# EAGLE design stm32l021 (EAGLE 9.6.2)
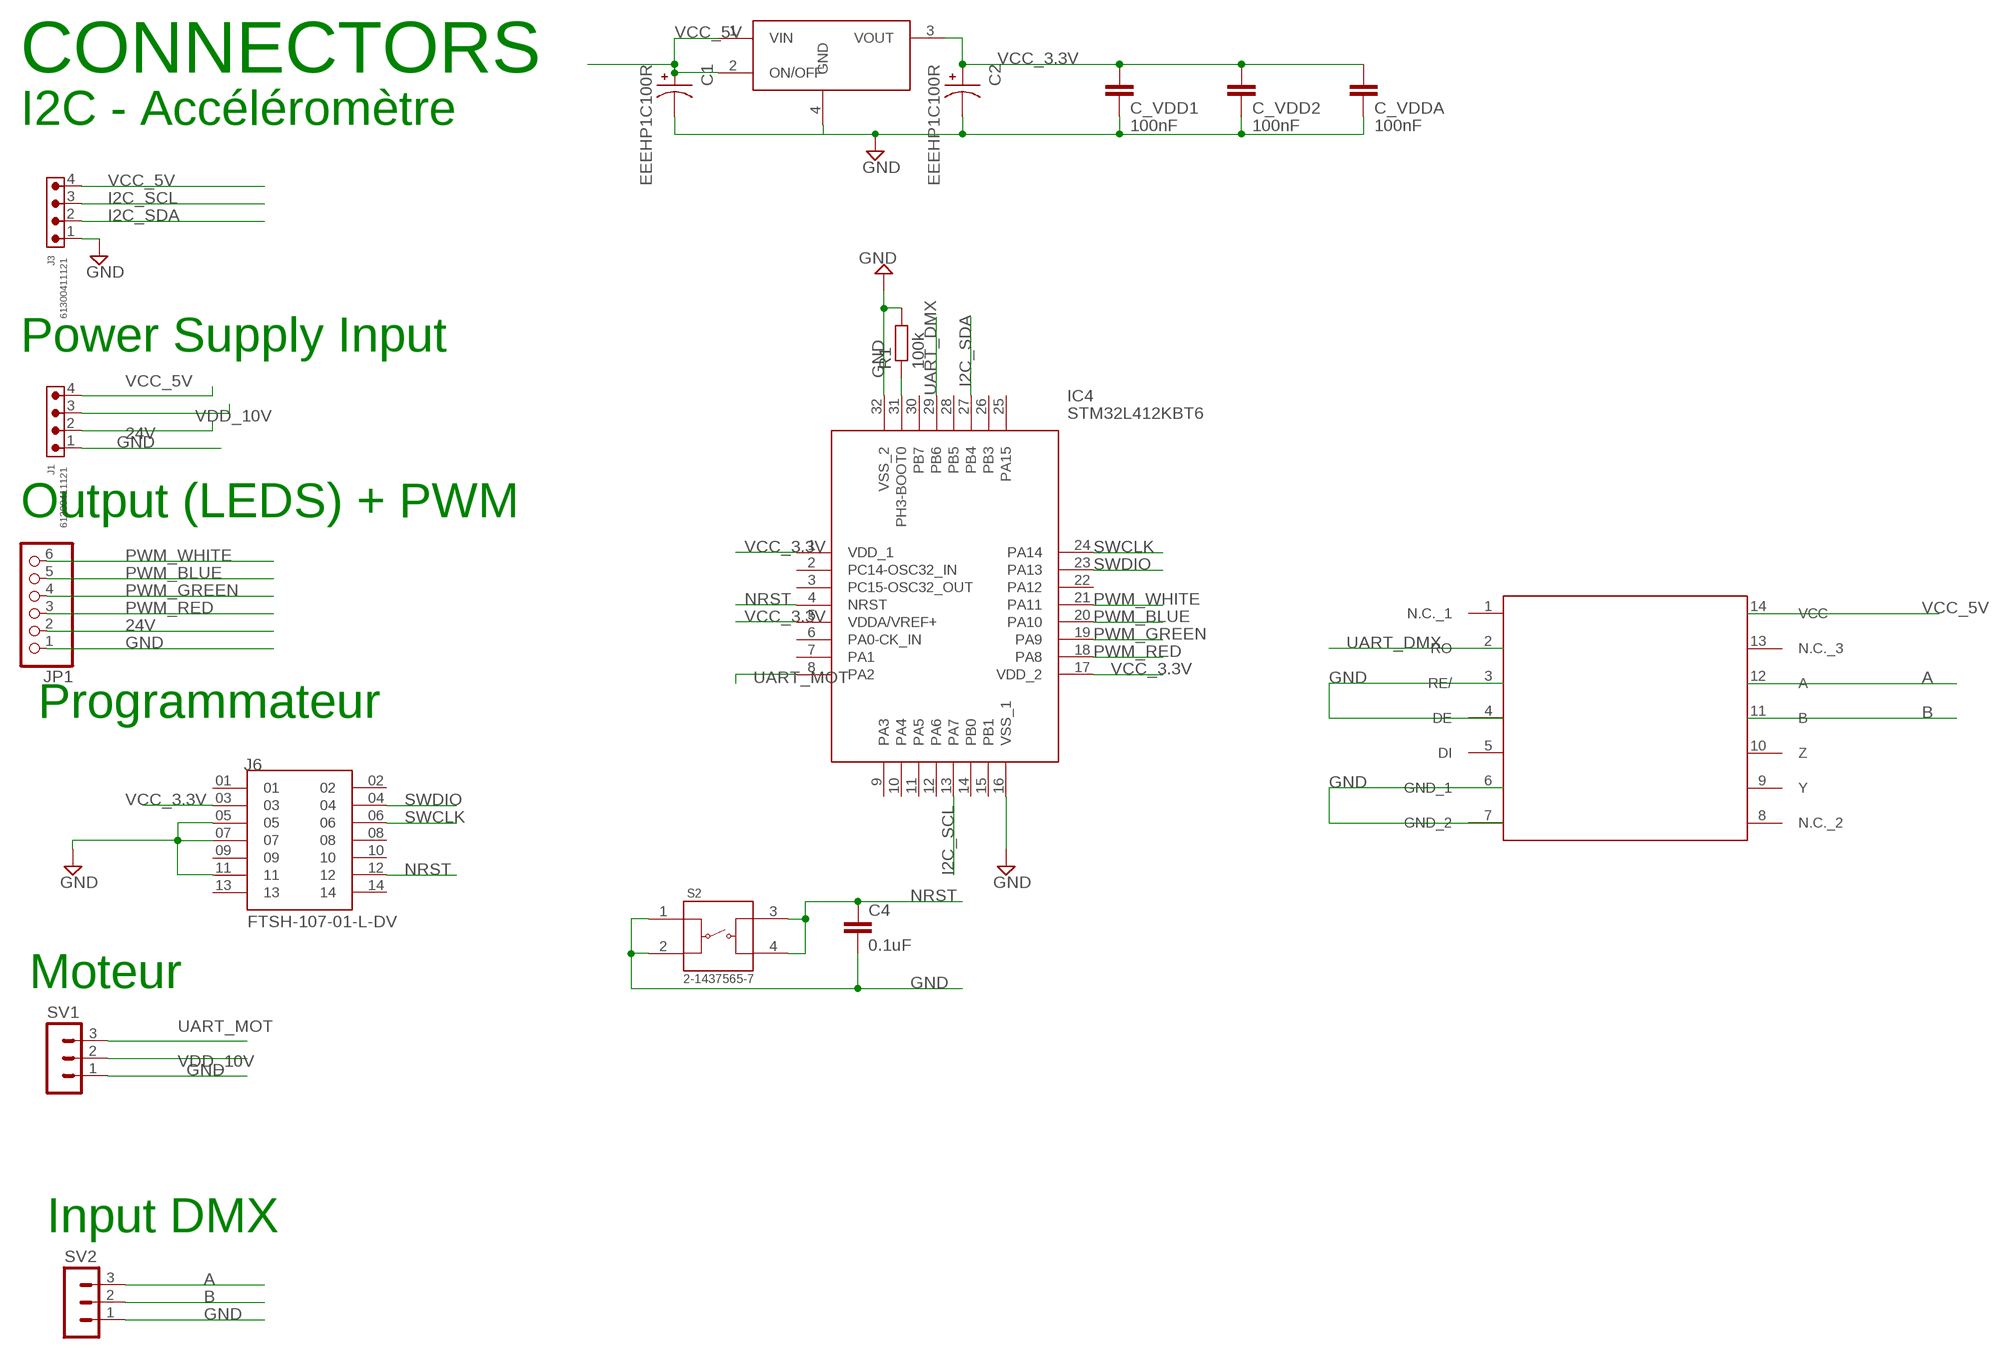
[diagram p0: schematic, sheet 1]

## Parts
C1  EEEHP1C100R  [CAP_EEEHP1C100R]
C2  EEEHP1C100R  [CAP_EEEHP1C100R]
C4  0.1uF  C-EUC0603  [C0603]
C_VDD1  100nF  C-EUC0603  [C0603]
C_VDD2  100nF  C-EUC0603  [C0603]
C_VDDA  100nF  C-EUC0603  [C0603]
IC4  STM32L412KBT6  [QFP80P900X900X160-32N]
J1  61300411121  6130XX11121_61300411121  [61300411121]
J3  61300411121  6130XX11121_61300411121  [61300411121]
J6  FTSH-107-01-L-DV  [SAMTEC_FTSH-107-01-L-DV]
JP1  PINHD-1X6  [1X06]
R1  100k  R-EU_R0603  [R0603]
S2  2-1437565-7  [SW_2-1437565-7]
SV1  MA03-1  [MA03-1]
SV2  MA03-1  [MA03-1]
U1  SOIC127P600X175-14N  [SOIC127P600X175-14N]
U$1  NCV33375ST3.3T3G  [VREG_NCP1117STAT3G]

## Nets
24V: J1.2 JP1.2
A: SV2.3 U1.12(A)
B: SV2.2 U1.11(B)
GND: C1.2 C2.2 C4.2 C_VDD1.2 C_VDD2.2 C_VDDA.2 IC4.16(VSS_1) IC4.32(VSS_2) J1.1 J3.1 J6.05 J6.07 J6.11 JP1.1 R1.2 S2.1 S2.2 SV1.1 SV2.1 U1.3(RE/) U1.4(DE) U1.6(GND_1) U1.7(GND_2) U$1.4(GND)
I2C_SCL: IC4.13(PA7) J3.3
I2C_SDA: IC4.27(PB4) J3.2
N$2: IC4.31(PH3-BOOT0) R1.1
NRST: C4.1 IC4.4(NRST) J6.12 S2.3 S2.4
PWM_BLUE: IC4.20(PA10) JP1.5
PWM_GREEN: IC4.19(PA9) JP1.4
PWM_RED: IC4.18(PA8) JP1.3
PWM_WHITE: IC4.21(PA11) JP1.6
SWCLK: IC4.24(PA14) J6.06
SWDIO: IC4.23(PA13) J6.04
UART_DMX: IC4.29(PB6) U1.2(RO)
UART_MOT: IC4.8(PA2) SV1.3
VCC_3.3V: C2.1 C_VDD1.1 C_VDD2.1 C_VDDA.1 IC4.1(VDD_1) IC4.5(VDDA/VREF+) IC4.17(VDD_2) J6.03 U$1.3(VOUT)
VCC_5V: C1.1 J1.4 J3.4 U1.14(VCC) U$1.1(VIN) U$1.2(ON/OFF)
VDD_10V: J1.3 SV1.2
Unconnected: IC4.2(PC14-OSC32_IN) IC4.3(PC15-OSC32_OUT) IC4.6(PA0-CK_IN) IC4.7(PA1) IC4.9(PA3) IC4.10(PA4) IC4.11(PA5) IC4.12(PA6) IC4.14(PB0) IC4.15(PB1) IC4.22(PA12) IC4.25(PA15) IC4.26(PB3) IC4.28(PB5) IC4.30(PB7) J6.01 J6.02 J6.08 J6.09 J6.10 J6.13 J6.14 U1.1(N.C._1) U1.5(DI) U1.8(N.C._2) U1.9(Y) U1.10(Z) U1.13(N.C._3)

## Notes on the sheet
- CONNECTORS
- I2C - Accéléromètre
- Power Supply Input
- Output (LEDS) + PWM
- Programmateur
- Moteur
- Input DMX

## Library data of the parts
C1 C2 = EEEHP1C100R:EEEHP1C100R: Check availability <https://pricing.snapeda.com/parts/EEEHP1C100R/Panasonic/view-part?ref=eda>; AVAILABILITY: In Stock; DESCRIPTION: Cap Aluminum Lytic 10uF 16V 20% (5 X 5.8mm) SMD 25mA 2000h 105C Automotive T/R; MF: Panasonic; MP: EEEHP1C100R; PACKAGE: RADIAL-2 Panasonic; PRICE: None; PURCHASE-URL: https://pricing.snapeda.com/search/part/EEEHP1C100R/?ref=eda
C4 C_VDD1 C_VDD2 C_VDDA = rcl:C-EU: CAPACITOR, European symbol; SPICEPREFIX: C
IC4 = STM32_librairy:STM32L412KBT6: ARM Microcontrollers - MCU Ultra-low-power Arm Cortex -M4 32-bit MCU+FPU, 100DMIPS up to 128KB Flash, 40KB SRAM, analog, ext. SMPS Source: Datasheet; DESCRIPTION: ARM Microcontrollers - MCU Ultra-low-power Arm Cortex -M4 32-bit MCU+FPU, 100DMIPS up to 128KB Flash, 40KB SRAM, analog, ext. SMPS; HEIGHT: 1.6mm; MANUFACTURER_NAME: STMicroelectronics; MANUFACTURER_PART_NUMBER: STM32L412KBT6; MOUSER_PART_NUMBER: 511-STM32L412KBT6; MOUSER_PRICE-STOCK: https://www.mouser.co.uk/ProductDetail/STMicroelectronics/STM32L412KBT6?qs=%252BEew9%252B0nqrD6o08jV%2F00TA%3D%3D
J1 J3 = Eagle_WR-PHD (rev21a):6130XX11121_61300411121: WR-PHD 2.54 mm THT Pin Header ARTICLE PROPERTIES: Pins:1;​ 2;​ 3;​ 4;​ 5;​ 6;​ 7;​ 8;​ 9;​ 10;​ 12;​ 13;​ 14;​ 15;​ 16;​ 18;​ 20;​ 22;​ 24;​ 25;​ 32;​ 36;​ 40 KIND PROPERTIES: Pitch：2.54 mm Quality Class:3 as per CECC 75 301-802 Rows：Single Gender：Pin Header Type：Straight MATERIAL PROPERTIES: Insulator Material :PBT Insulator Flammability Rating:UL94 V-0 Contact Material:Copper Alloy Contact Plating:Gold Contact Type:Stamped GENERAL INFORMATION Operating Temperature:-40 up to +105 °C Compliance:RoHS ELECTRICAL PROPERTIES: Rated Current:3 A IR 1:3 A Withstanding Voltage:500 V (AC) Contact Resistance:20 mΩ RISO:1000 MΩ CERTIFICATION UL Approval:E323964 PACKAGING PROPERTIES Packaging:Bag <https://katalog.we-online.com/media/images/v2/o33211v209%20Family_BTB_PHD_6130xx11121.jpg> Details see: https://katalog.we-online.com/en/em/PHD_2_54_THT_PIN_HEADER_6130XX11121 Updated by Yingchun,Shan 2019-10-16 2019 (C) Würth Elektronik; DATASHEET-URL: https://www.we-online.com/catalog/datasheet/61300411121.pdf; GENDER: Pin Header; IR: 3A; MOUNT: THT; PACKAGING: Bag; PART-NUMBER: 61300411121; PINS: 4; PITCH: 2.54mm; ROWS: Single; TYPE: Straight
J6 = FTSH-107-01-L-DV:FTSH-107-01-L-DV; MANUFACTURER: Samtec; PARTREV: R; STANDARD: Manufacturer Recommendations
JP1 = pinhead:PINHD-1X6: PIN HEADER
R1 = rcl:R-EU_: RESISTOR, European symbol; SPICEPREFIX: R
S2 = 2-1437565-7:2-1437565-7: FSM2JSMA=SMT,TACTILE,PB SWITCH Check availability <https://pricing.snapeda.com/parts/FSM2JSMA/TE%20Connectivity/view-part?ref=eda>; AVAILABILITY: In Stock; COMMENT: 2-1437565-7; CONFIGURATION_POLE-THROW: Single Pole - Single Throw; CONTACT_CURRENT_RATING: 50 mA; DESCRIPTION: Tactile Switch SPST-NO Top Actuated Surface Mount; MF: TE Connectivity; MP: FSM2JSMA; PACKAGE: None; PRICE: None; PURCHASE-URL: https://pricing.snapeda.com/search/part/FSM2JSMA/?ref=eda
SV1 SV2 = con-lstb:MA03-1: PIN HEADER; OC_FARNELL: unknown; OC_NEWARK: unknown
U1 = MAX491ESD+:SOIC127P600X175-14N; A1_MAX: None; A1_MIN: 0.25; A1_NOM: None; A_MAX: 1.75; A_MIN: 1.75; A_NOM: 1.75; B_MAX: 0.49; B_MIN: 0.35; B_NOM: 0.42; D2_MAX: 0.0; D2_MIN: None; D2_NOM: None; D_MAX: 8.75; D_MIN: 8.55; D_NOM: 8.65; E1_MAX: 4.0; E1_MIN: 3.8; E1_NOM: 3.9; E2_MAX: 0.0; E2_MIN: None; E2_NOM: None; ENOM: 1.27; E_MAX: 6.2; E_MIN: 5.8; E_NOM: 6.0; L_MAX: 1.27; L_MIN: 0.4; L_NOM: 0.835; MANUFACTURER: Maxim Integrated; PIN_COUNT: 14.0; SNAPEDA_PACKAGE_ID: 6188; STANDARD: IPC 7351B
U$1 = VREG_NCP1117STAT3G:NCV33375ST3.3T3G

## Board
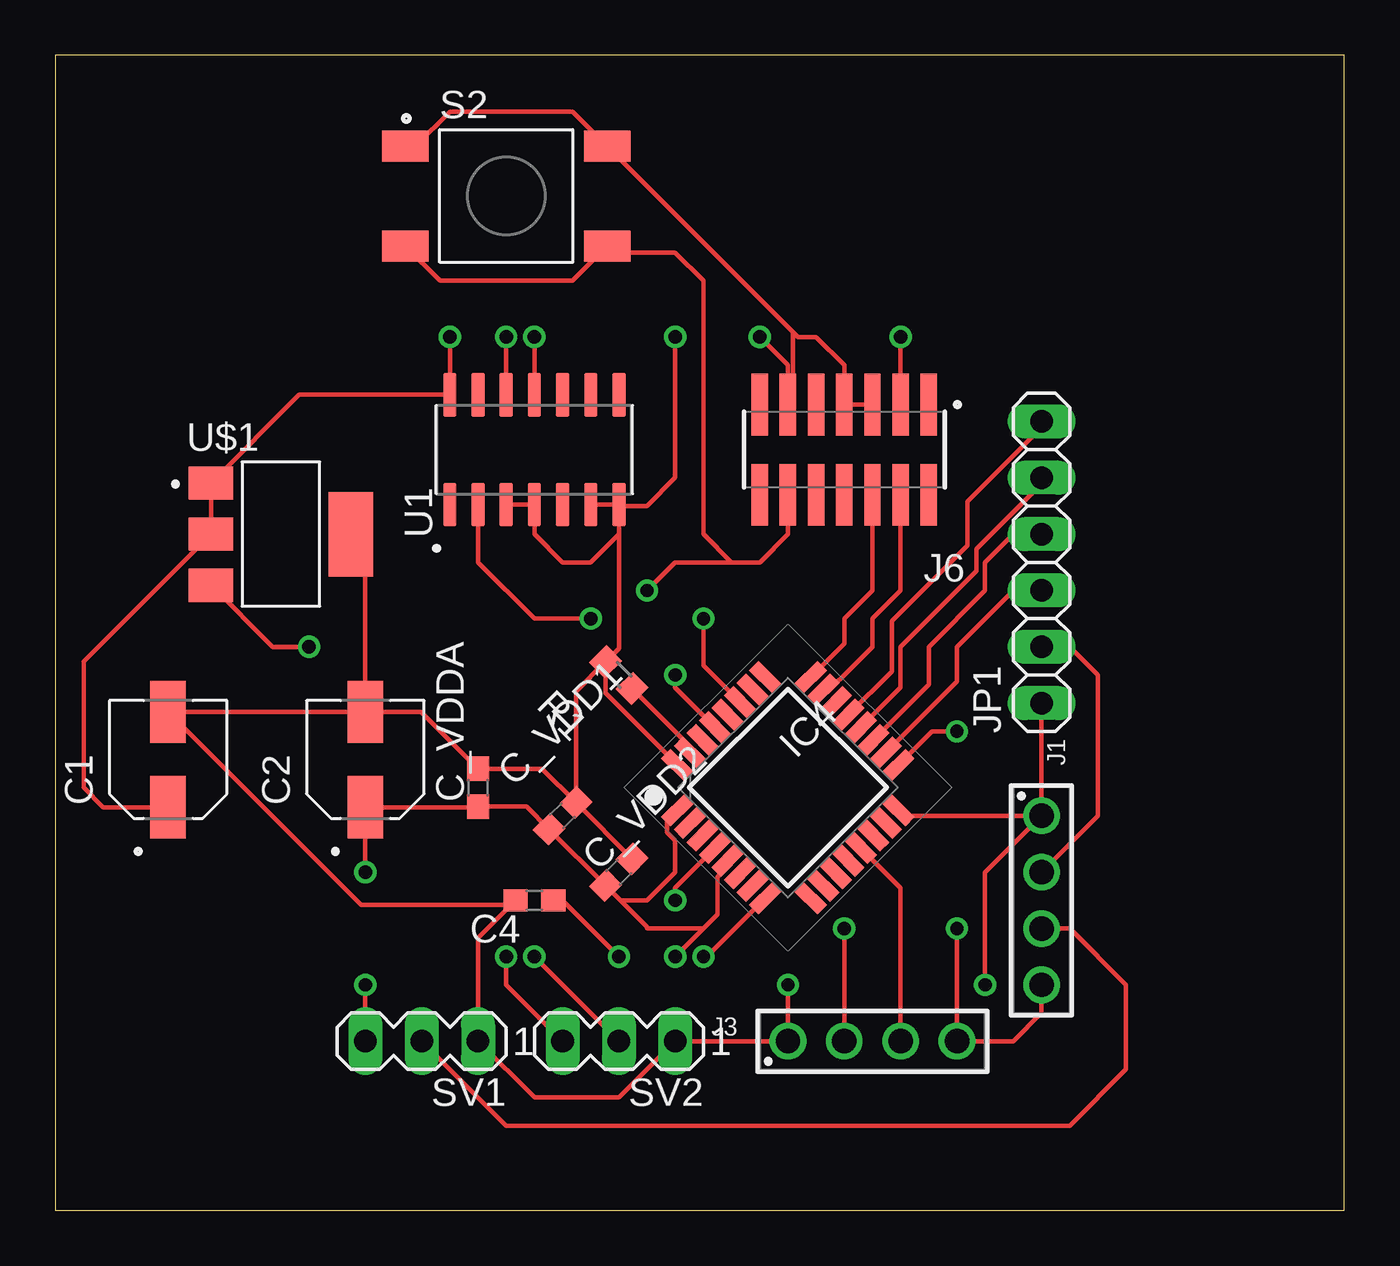
[diagram p1: board, top side]
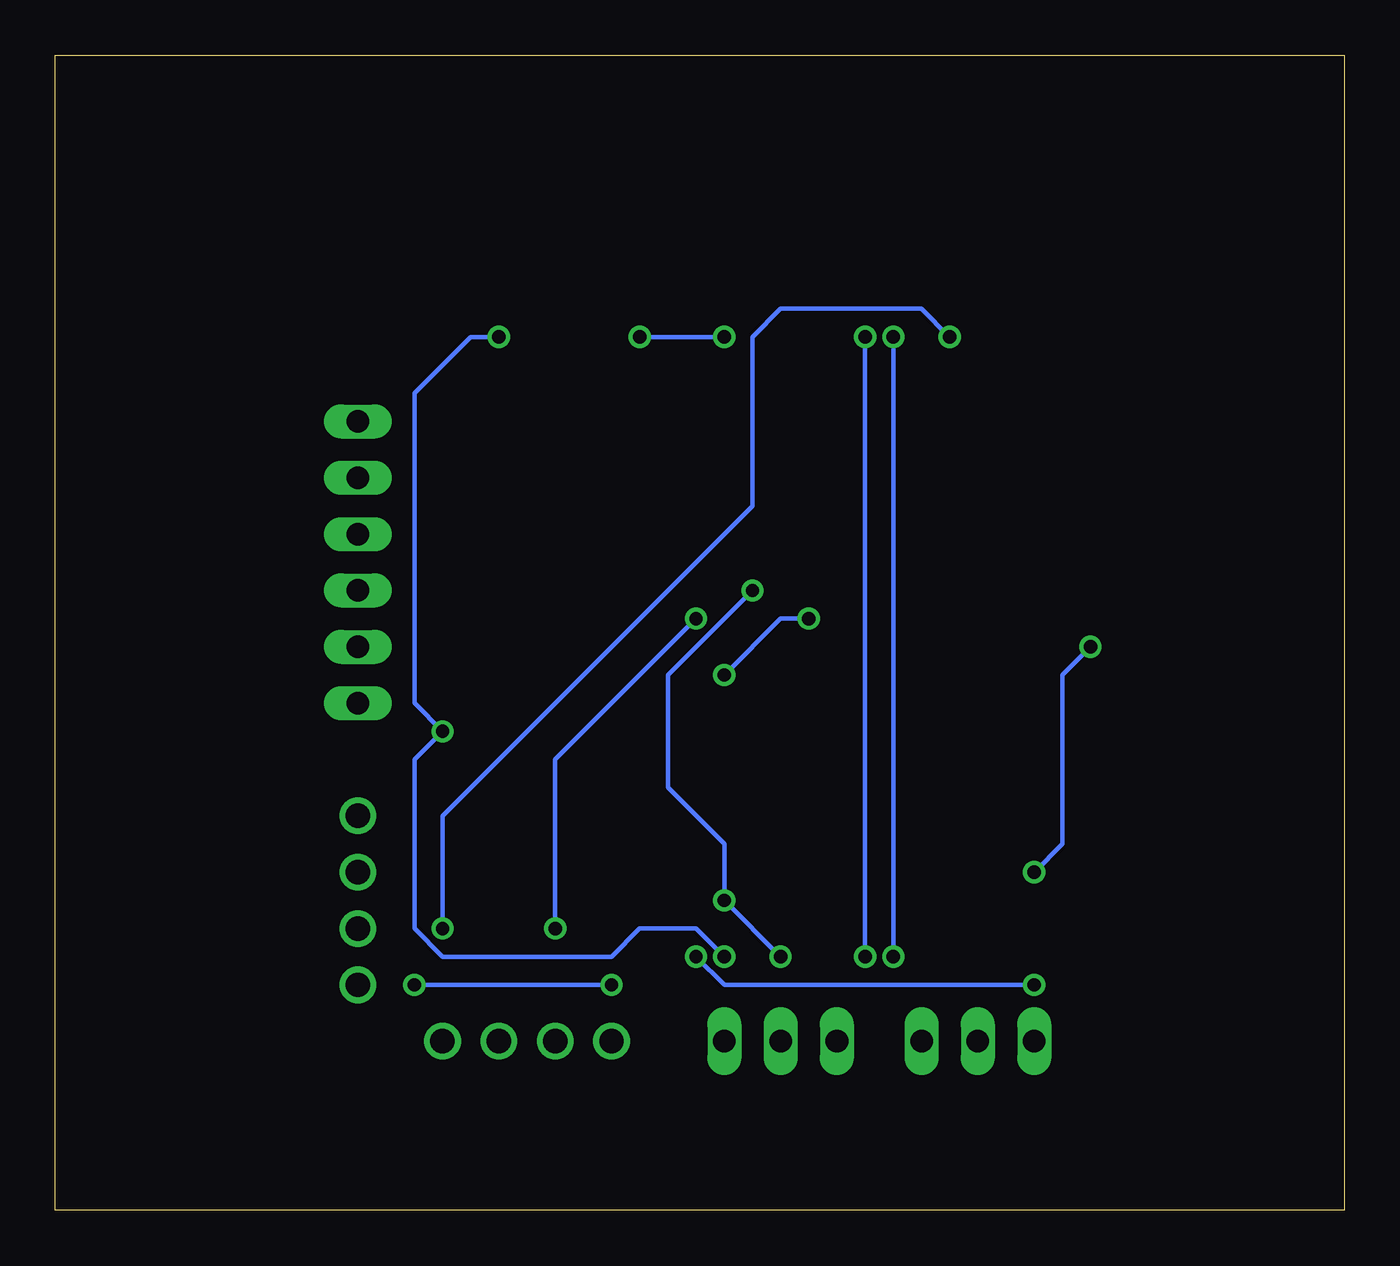
[diagram p2: board, bottom side, seen from below]

Size 58.09 x 52.06 mm. Coordinates in mm from the lower left corner, seen from the top.
Outline: 0,0 58.09,0 58.09,52.06 0,52.06 0,0
Copper layers (1*16): Top 0.035mm / dielectric 1.5mm / Bottom 0.035mm
Design rules "ENSEA_2022_04_08": minimum track width 0.2mm, minimum drill 0.6mm, track to track 0.2mm, track to pad 0.2mm, pad to pad 0.185mm, via to via 0.2mm, smd to smd 0.185mm, copper to edge 1mm, drill to drill 0.4mm, minimum pad ring 0.2mm, minimum via ring 0.2mm, stop-mask expansion 4mil, vias tented up to drill 0mil, thermal gap 0.4mm

### Footprints (pad centres in the part's own frame; a part is rotated, then mirrored left to right if it is on the bottom)
CAP_EEEHP1C100R = smd 2.8 x 1.6: 1 -2.15,0; 2 2.15,0
C0603 = smd 1.1 x 1: 1 -0.85,0; 2 0.85,0
QFP80P900X900X160-32N = smd 1.475 x 0.6: 1 -4.238,2.8; 2 -4.238,2; 3 -4.238,1.2; 4 -4.238,0.4; 5 -4.238,-0.4; 6 -4.238,-1.2; 7 -4.238,-2; 8 -4.238,-2.8; 17 4.238,-2.8; 18 4.238,-2; 19 4.238,-1.2; 20 4.238,-0.4; 21 4.238,0.4; 22 4.238,1.2; 23 4.238,2; 24 4.238,2.8 | smd 0.6 x 1.475: 9 -2.8,-4.238; 10 -2,-4.238; 11 -1.2,-4.238; 12 -0.4,-4.238; 13 0.4,-4.238; 14 1.2,-4.238; 15 2,-4.238; 16 2.8,-4.238; 25 2.8,4.238; 26 2,4.238; 27 1.2,4.238; 28 0.4,4.238; 29 -0.4,4.238; 30 -1.2,4.238; 31 -2,4.238; 32 -2.8,4.238
61300411121 = drill 1.1: 1 -3.81,0; 2 -1.27,0; 3 1.27,0; 4 3.81,0
SAMTEC_FTSH-107-01-L-DV = smd 0.74 x 2.79: 01 -3.81,-2.035; 02 -3.81,2.035; 03 -2.54,-2.035; 04 -2.54,2.035; 05 -1.27,-2.035; 06 -1.27,2.035; 07 0,-2.035; 08 0,2.035; 09 1.27,-2.035; 10 1.27,2.035; 11 2.54,-2.035; 12 2.54,2.035; 13 3.81,-2.035; 14 3.81,2.035
1X06 = drill 1.016 long: 1 -6.35,0; 2 -3.81,0; 3 -1.27,0; 4 1.27,0; 5 3.81,0; 6 6.35,0
R0603 = smd 1 x 1.1: 1 -0.85,0; 2 0.85,0
SW_2-1437565-7 = smd 2.1 x 1.4: 1 -4.55,2.25; 2 4.55,2.25; 3 -4.55,-2.25; 4 4.55,-2.25
MA03-1 = drill 1.016 long: 1 -2.54,0; 2 0,0; 3 2.54,0
SOIC127P600X175-14N = smd 1.97 x 0.59: 1 -2.475,3.81; 2 -2.475,2.54; 3 -2.475,1.27; 4 -2.475,0; 5 -2.475,-1.27; 6 -2.475,-2.54; 7 -2.475,-3.81; 8 2.475,-3.81; 9 2.475,-2.54; 10 2.475,-1.27; 11 2.475,0; 12 2.475,1.27; 13 2.475,2.54; 14 2.475,3.81
VREG_NCP1117STAT3G = smd 2 x 1.5: 1 -3.15,2.3; 2 -3.15,0; 3 -3.15,-2.3 | smd 2 x 3.8: 4 3.15,0

### Placement (x,y rotation side)
C1  5.08,20.32 90 top
C2  13.97,20.32 90 top
C4  21.59,13.97 180 top
C_VDD1  22.86,17.78 45 top
C_VDD2  25.4,15.24 45 top
C_VDDA  19.05,19.05 90 top
IC4  33.02,19.05 45 top
J1  44.45,13.97 270 top
J3  36.83,7.62 0 top
J6  35.56,34.29 180 top
JP1  44.45,29.21 90 top
R1  25.4,24.13 135 top
S2  20.32,45.72 0 top
SV1  16.51,7.62 180 top
SV2  25.4,7.62 180 top
U1  21.59,34.29 90 top
U$1  10.16,30.48 0 top

### Tracks (layer width: path | path; a pad name or v marks a point on that pad's centre or on a via)
24V
  Top 0.2: J1.2 46.99,17.78 46.99,24.13 45.72,25.4 JP1.2
A  (via drill 0.6)
  Top 0.2: SV2.3 20.32,10.16 v20.32,11.43 | U1.12 v20.32,39.37
  Bottom 0.2: v20.32,39.37 v20.32,11.43
B  (via drill 0.6)
  Top 0.2: SV2.2 v21.59,11.43 | U1.11 v21.59,39.37
  Bottom 0.2: v21.59,11.43 v21.59,39.37
GND  (via drill 0.6)
  Top 0.2: U$1.4 13.97,29.82 13.97,22.86 | 13.97,22.86 C2.2 16.48,22.47 C_VDDA.2 21.94,19.9 C_VDD1.2 | C_VDD1.2 C_VDD2.2 | R1.2 24.8,23.31 IC4.32 | C_VDD1.2 23.46,23.39 R1.2 | R1.2 25.4,25.33 U1.7 | U1.3 U1.4 21.59,30.48 22.86,29.21 24.13,29.21 25.4,30.48 U1.7 | IC4.16 38.25,17.78 J1.1 | JP1.1 J1.1 | v33.02,10.16 J3.1 SV2.1 25.4,5.08 21.59,5.08 SV1.1 19.05,12.28 20.53,13.76 | 20.53,13.76 C4.2 | J6.05 J6.07 35.56,38.1 34.29,39.37 33.47,39.37 33.24,39.59 | 33.24,39.59 S2.2 23.31,49.53 17.78,49.53 16.22,47.97 S2.1 | 20.53,13.76 13.79,13.76 C1.2 13.58,22.47 13.97,22.86 | 33.24,39.59 33.24,36.55 J6.11 33.02,38.1 v31.75,39.37 | U1.6 U1.7 | J1.1 41.91,15.24 v41.91,10.16 | U1.7 25.46,31.75 26.67,31.75 27.94,33.02 v27.94,39.37
  Bottom 0.2: v33.02,10.16 v41.91,10.16 | v27.94,39.37 v31.75,39.37
I2C_SCL
  Top 0.2: IC4.13 38.1,14.54 J3.3
I2C_SDA  (via drill 0.6)
  Top 0.2: J3.2 v35.56,12.7 | IC4.27 29.21,24.56 v29.21,26.67
  Bottom 0.2: v29.21,26.67 35.56,20.32 v35.56,12.7
N$2
  Top 0.2: R1.1 28.14,21.39 28.14,21.38 28.61,20.91 IC4.31
NRST  (via drill 0.6)
  Top 0.2: IC4.4 27.94,14.54 v27.94,13.97 | S2.3 17.33,41.91 23.31,41.91 S2.4 25.16,43.18 27.94,43.18 29.21,41.91 29.21,30.48 30.48,29.21 | C4.1 22.86,13.97 v25.4,11.43 | J6.12 33.02,30.48 31.75,29.21 30.48,29.21 | 30.48,29.21 27.94,29.21 v26.67,27.94
  Bottom 0.2: v25.4,11.43 v27.94,13.97 27.94,16.51 30.48,19.05 30.48,24.13 v26.67,27.94
PWM_BLUE
  Top 0.2: IC4.20 38.1,23.56 38.1,25.4 41.51,28.81 41.51,29.8 44.45,32.74 JP1.5
PWM_GREEN
  Top 0.2: 36.87,21.48 IC4.19 39.37,23.7 39.37,25.4 41.91,27.94 41.91,29.21 43.18,30.48 JP1.4
PWM_RED
  Top 0.2: IC4.18 40.64,23.84 40.64,25.4 43.18,27.94 JP1.3
PWM_WHITE
  Top 0.2: IC4.21 37.7,24.3 37.7,26.56 41.11,29.97 41.11,31.94 44.45,35.28 JP1.6
SWCLK
  Top 0.2: IC4.24 35.56,25.55 35.56,26.67 36.83,27.94 J6.06
SWDIO
  Top 0.2: J6.04 38.1,27.94 36.83,26.67 36.83,25.4 35.36,23.93 35.35,23.93 34.88,23.46 IC4.23
UART_DMX  (via drill 0.6)
  Top 0.2: IC4.29 27.94,23.56 v27.94,24.13 | U1.2 19.05,29.21 21.59,26.67 v24.13,26.67
  Bottom 0.2: v24.13,26.67 25.4,26.67 v27.94,24.13
UART_MOT  (via drill 0.6)
  Top 0.2: 31.85,14.07 IC4.8 29.36,11.43 v29.21,11.43 | 13.97,8.89 SV1.3 v13.97,10.16
  Bottom 0.2: v29.21,11.43 27.94,10.16 v13.97,10.16
VCC_3.3V  (via drill 0.6)
  Top 0.2: C_VDD2.1 25.47,13.97 26.67,13.97 27.94,15.24 27.94,16.67 27.57,17.03 27.57,17.57 IC4.1 | C_VDD2.1 C_VDD1.1 21.24,18.2 C_VDDA.1 19.02,18.17 C2.1 v13.97,15.24 | IC4.17 39.52,21.59 v40.64,21.59 | C_VDD2.1 26.67,12.77 26.67,12.7 29.21,12.7 | IC4.5 30.31,15.49 29.84,15.02 29.84,13.33 29.21,12.7 | J6.03 v38.1,39.37 | U$1.3 9.79,25.4 v11.43,25.4 | 29.21,12.7 v27.94,11.43
  Bottom 0.2: v38.1,39.37 39.37,39.37 41.91,36.83 41.91,22.86 v40.64,21.59 41.91,20.32 41.91,12.7 40.64,11.43 33.02,11.43 31.75,12.7 29.21,12.7 v27.94,11.43 | v11.43,25.4 12.7,24.13 12.7,16.51 v13.97,15.24
VCC_5V  (via drill 0.6)
  Top 0.2: J1.4 44.45,8.89 43.18,7.62 J3.4 v40.64,12.7 | v17.78,39.37 U1.14 10.99,36.77 U$1.1 U$1.2 1.27,24.74 1.27,19.05 2.15,18.17 C1.1
  Bottom 0.2: v40.64,12.7 40.64,17.78 26.67,31.75 26.67,39.37 25.4,40.64 19.05,40.64 v17.78,39.37
VDD_10V
  Top 0.2: SV1.2 20.32,3.81 45.72,3.81 48.26,6.35 48.26,10.16 45.72,12.7 J1.3